# Altium schematic sheet Others.SchDoc
size A4; SheetNumber: 7; SheetTotal: 7
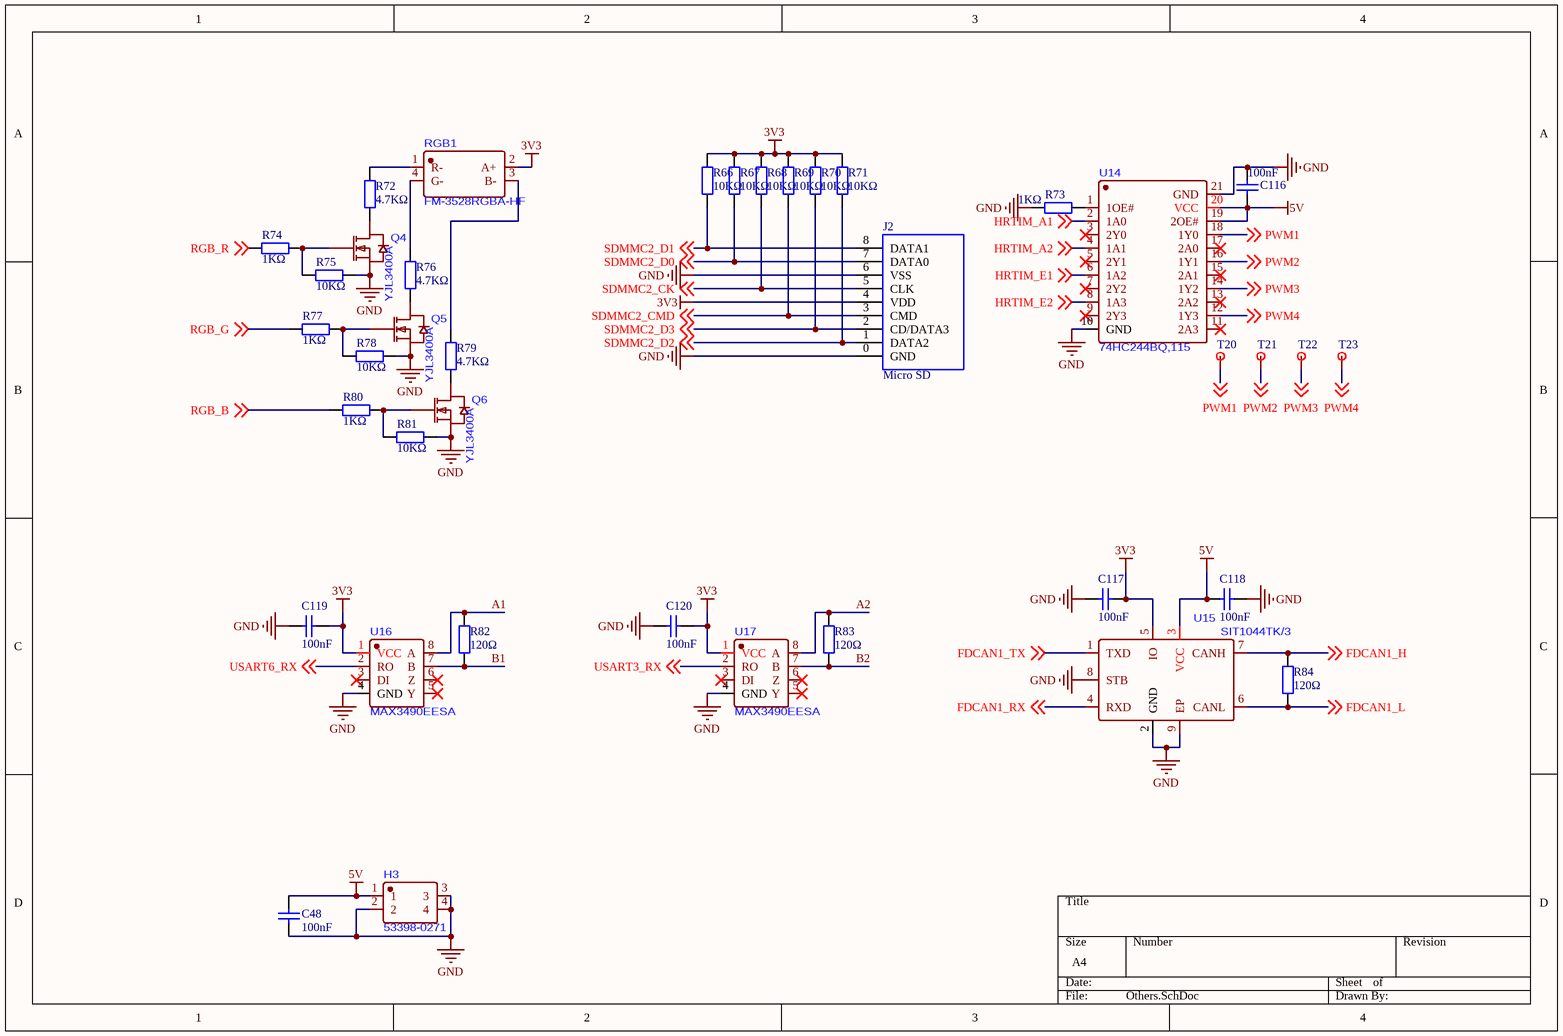
[diagram p0: Others.SchDoc]

## Parts
C48  100nF  [0402_C]
C116  100nF  [0402_C]
C117  100nF  [0402_C]
C118  100nF  [0402_C]
C119  100nF  [0402_C]
C120  100nF  [0402_C]
H3  53398-0271  [CONN-SMD_2P-P1.25_53398-0271]
J2  Micro SD  [SD卡座短]
Q4  YJL3400A  [SOT-23-3_L2.9-W1.3-P1.90-LS2.4-BR]
Q5  YJL3400A  [SOT-23-3_L2.9-W1.3-P1.90-LS2.4-BR]
Q6  YJL3400A  [SOT-23-3_L2.9-W1.3-P1.90-LS2.4-BR]
R66  10KΩ  [0402_R]
R67  10KΩ  [0402_R]
R68  10KΩ  [0402_R]
R69  10KΩ  [0402_R]
R70  10KΩ  [0402_R]
R71  10KΩ  [0402_R]
R72  4.7KΩ  [0402_R]
R73  1KΩ  [0402_R]
R74  1KΩ  [0402_R]
R75  10KΩ  [0402_R]
R76  4.7KΩ  [0402_R]
R77  1KΩ  [0402_R]
R78  10KΩ  [0402_R]
R79  4.7KΩ  [0402_R]
R80  1KΩ  [0402_R]
R81  10KΩ  [0402_R]
R82  120Ω  [0402_R]
R83  120Ω  [0402_R]
R84  120Ω  [0402_R]
RGB1  FM-3528RGBA-HF  [LED-SMD_4P-L3.2-W2.8-LS3.5-BR-1]
T20  testpoint  [testpoint]  (value not drawn)
T21  testpoint  [testpoint]  (value not drawn)
T22  testpoint  [testpoint]  (value not drawn)
T23  testpoint  [testpoint]  (value not drawn)
U14  74HC244BQ,115  [DHVQFN20_L4.5-W2.5-P0.50-BL-EP]
U15  SIT1044TK/3  [TDFN-8_L3.0-W3.0-P0.65-BL-EP]
U16  MAX3490EESA  [SOIC-8_L4.9-W3.9-P1.27-LS6.0-BL]
U17  MAX3490EESA  [SOIC-8_L4.9-W3.9-P1.27-LS6.0-BL]

## Nets
3V3: C117.1 C119.1 C120.1 J2.4(VDD) R66.2 R67.2 R68.2 R69.2 R70.2 R71.2 RGB1.2(A+) U15.5(IO) U16.1(VCC) U17.1(VCC)
5V: C48.1 C116.1 C118.2 H3.1 U14.19(2OE#) U14.20(VCC) U15.3(VCC)
GND: C48.2 C116.2 C117.2 C118.1 C119.2 C120.2 H3.2 H3.3 H3.4 J2.0(GND) J2.6(VSS) Q4.2(S) Q5.2(S) Q6.2(S) R73.1 R75.2 R78.2 R81.2 U14.10(GND) U14.21(GND) U15.2(GND) U15.8(STB) U15.9(EP) U16.4(GND) U17.4(GND)
A1: R82.2 U16.8(A)
A2: R83.2 U17.8(A)
B1: R82.1 U16.7(B)
B2: R83.1 U17.7(B)
FDCAN1_H: R84.2 U15.7(CANH) ; off-sheet FDCAN1_H
FDCAN1_L: R84.1 U15.6(CANL) ; off-sheet FDCAN1_L
FDCAN1_RX: U15.4(RXD) ; off-sheet FDCAN1_RX
FDCAN1_TX: U15.1(TXD) ; off-sheet FDCAN1_TX
HRTIM_A1: U14.2(1A0) ; off-sheet HRTIM_A1
HRTIM_A2: U14.4(1A1) ; off-sheet HRTIM_A2
HRTIM_E1: U14.6(1A2) ; off-sheet HRTIM_E1
HRTIM_E2: U14.8(1A3) ; off-sheet HRTIM_E2
PWM1: T20.1(R) U14.18(1Y0) ; off-sheet PWM1
PWM2: T21.1(R) U14.16(1Y1) ; off-sheet PWM2
PWM3: T22.1(R) U14.14(1Y2) ; off-sheet PWM3
PWM4: T23.1(R) U14.12(1Y3) ; off-sheet PWM4
RGB_B: R80.1 ; off-sheet RGB_B
RGB_G: R77.1 ; off-sheet RGB_G
RGB_R: R74.1 ; off-sheet RGB_R
SDMMC2_CK: J2.5(CLK) R68.1 ; off-sheet SDMMC2_CK
SDMMC2_CMD: J2.3(CMD) R69.1 ; off-sheet SDMMC2_CMD
SDMMC2_D0: J2.7(DATA0) R67.1 ; off-sheet SDMMC2_D0
SDMMC2_D1: J2.8(DATA1) R66.1 ; off-sheet SDMMC2_D1
SDMMC2_D2: J2.1(DATA2) R71.1 ; off-sheet SDMMC2_D2
SDMMC2_D3: J2.2(CD/DATA3) R70.1 ; off-sheet SDMMC2_D3
USART3_RX: U17.2(RO) ; off-sheet USART3_RX
USART6_RX: U16.2(RO) ; off-sheet USART6_RX
NetQ4_1: Q4.1(G) R74.2 R75.1
NetQ4_3: Q4.3(D) R72.1
NetQ5_1: Q5.1(G) R77.2 R78.1
NetQ5_3: Q5.3(D) R76.1
NetQ6_1: Q6.1(G) R80.2 R81.1
NetQ6_3: Q6.3(D) R79.1
NetR72_2: R72.2 RGB1.1(R-)
NetR73_2: R73.2 U14.1(1OE#)
NetR76_2: R76.2 RGB1.4(G-)
NetR79_2: R79.2 RGB1.3(B-)

Not connected (* = marked no-connect by the designer): U14 3(2Y0)* 5(2Y1)* 7(2Y2)* 9(2Y3)* 11(2A3)* 13(2A2)* 15(2A1)* 17(2A0)*; U16 3(DI)* 5(Y)* 6(Z)*; U17 3(DI)* 5(Y)* 6(Z)*

## Library data of the parts
C48 C116-C120 = 0402 100nF (104) 10% 16V: 贴片电容; ComponentLink1Description: 供应商链接; ComponentLink1URL: http://www.szlcsc.com/product/details_1877.html; Package: 0402; Supplier: LC; SuppliersPartNumber: C1525
J2 = SD卡 短: Micro SD卡; 版权归属: 黎明电子style; BOM名称: Micro SD卡; 学习资源: https://lmdzstyle.taobao.com/
R66-R81 = 0402 10KΩ (1002) 1%: 贴片电阻; ComponentLink1Description: 供应商链接; ComponentLink1URL: http://www.szlcsc.com/product/details_26487.html; Package: 0402; Supplier: LC; SuppliersPartNumber: C25744
R82-R84 = 0402 120Ω (1200) 1%: 贴片电阻; ComponentLink1Description: 供应商链接; ComponentLink1URL: http://www.szlcsc.com/product/details_25822.html; Package: 0402; Supplier: LC; SuppliersPartNumber: C25079